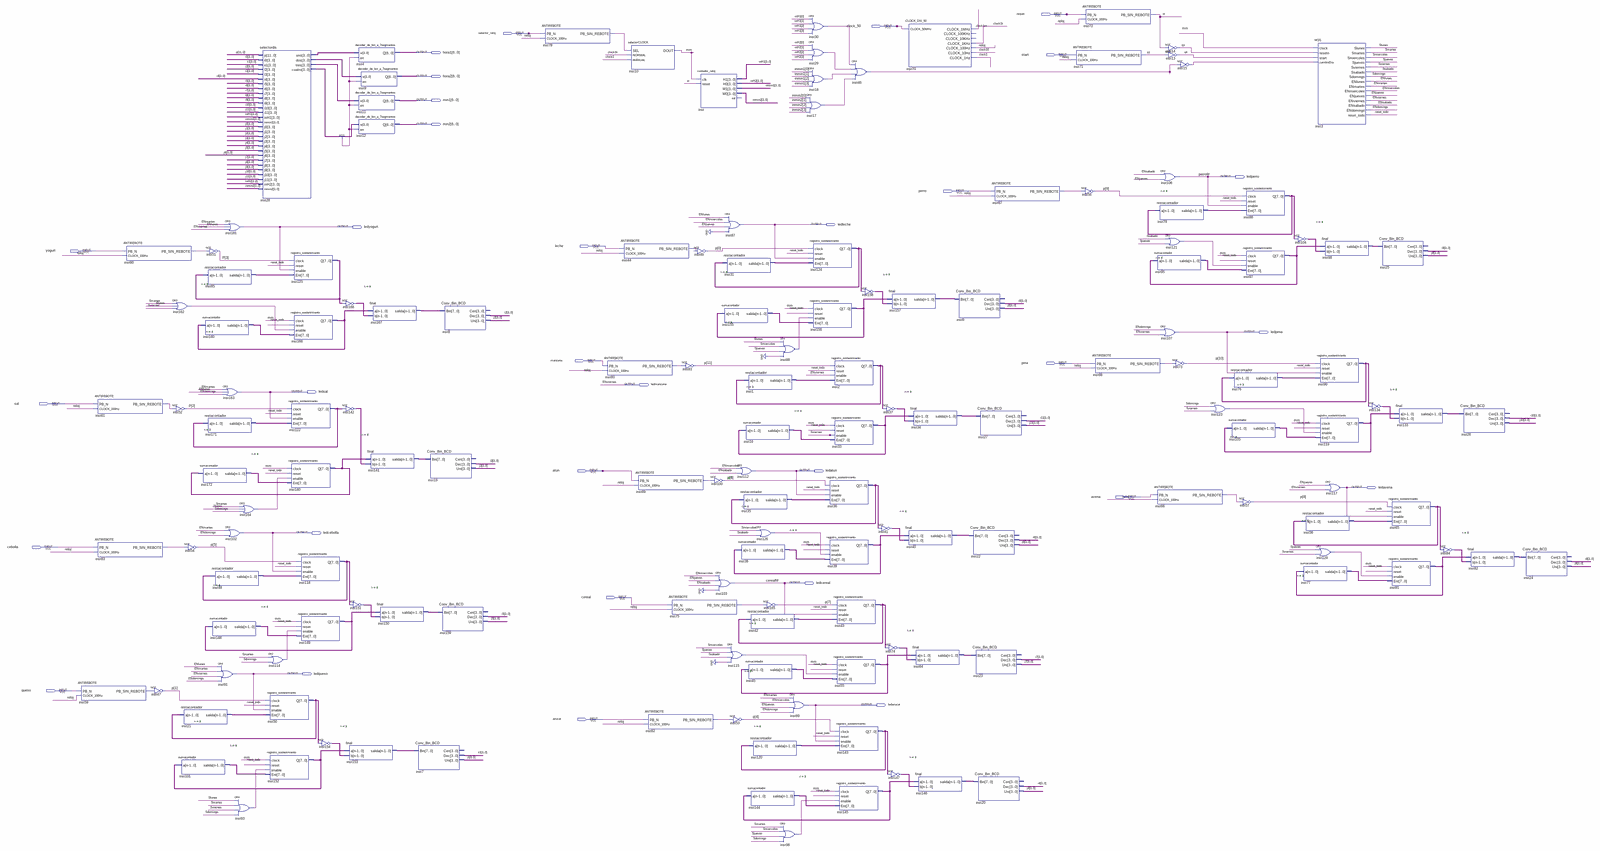
[diagram p0: schematic sheet, whole]
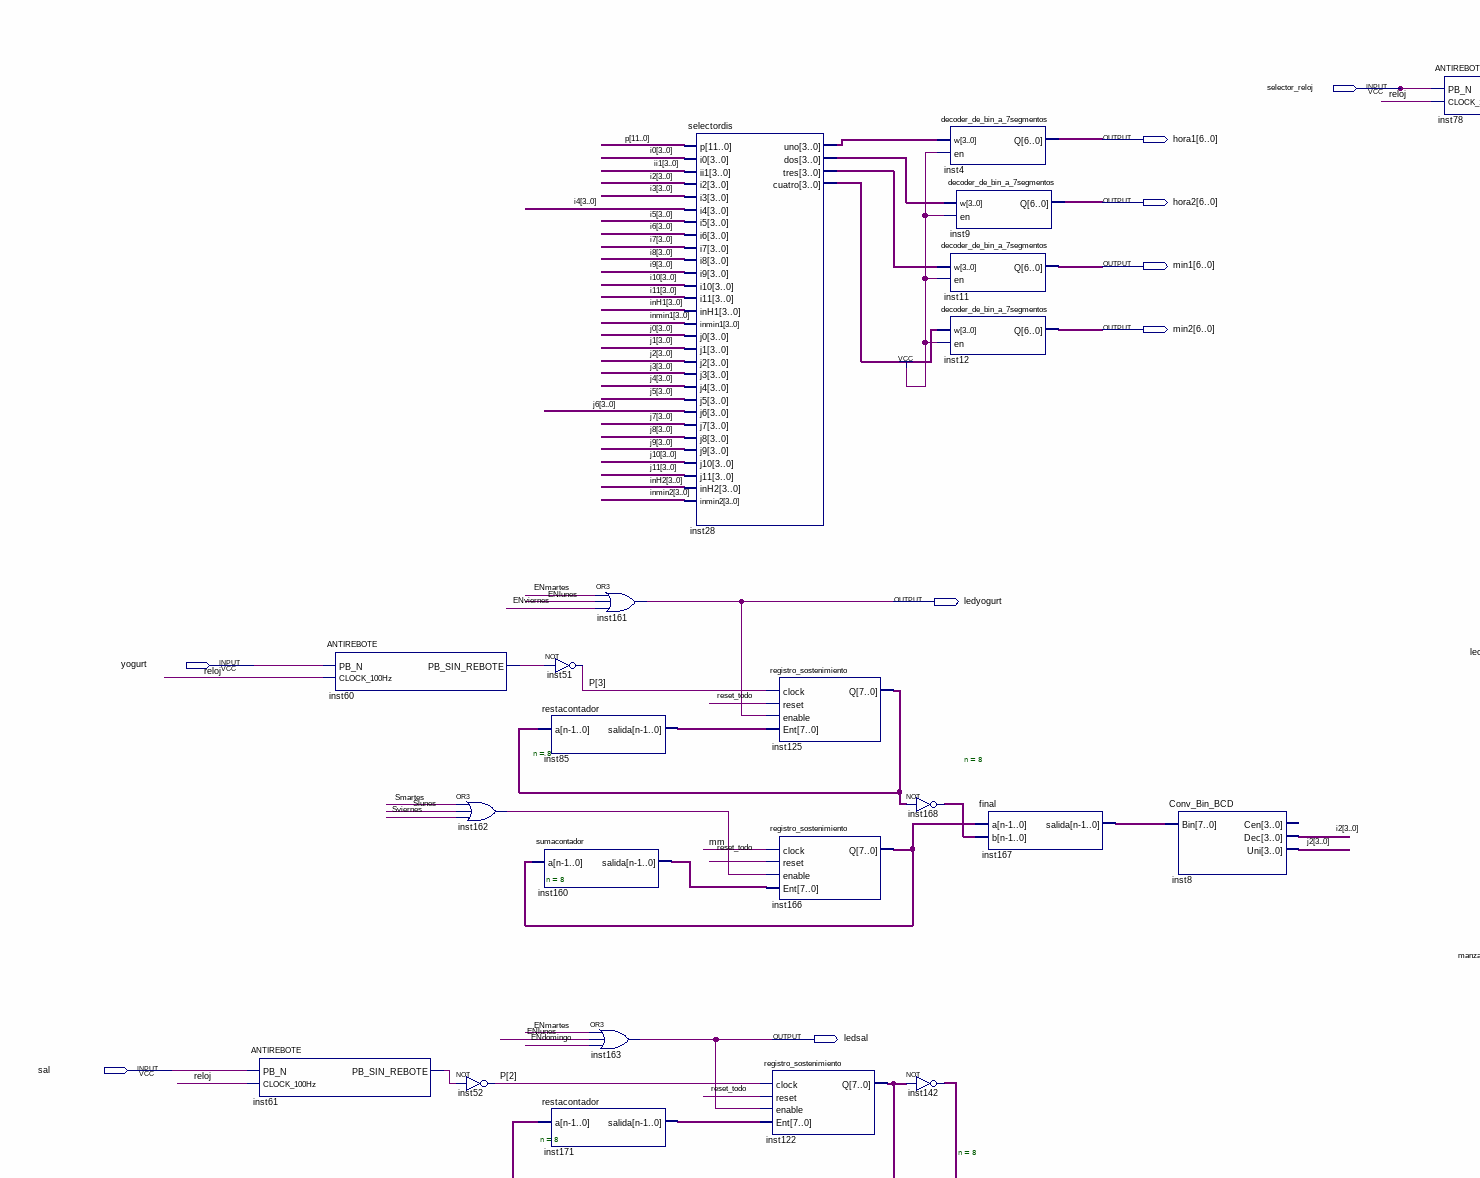
[diagram p1: schematic sheet, upper left part]
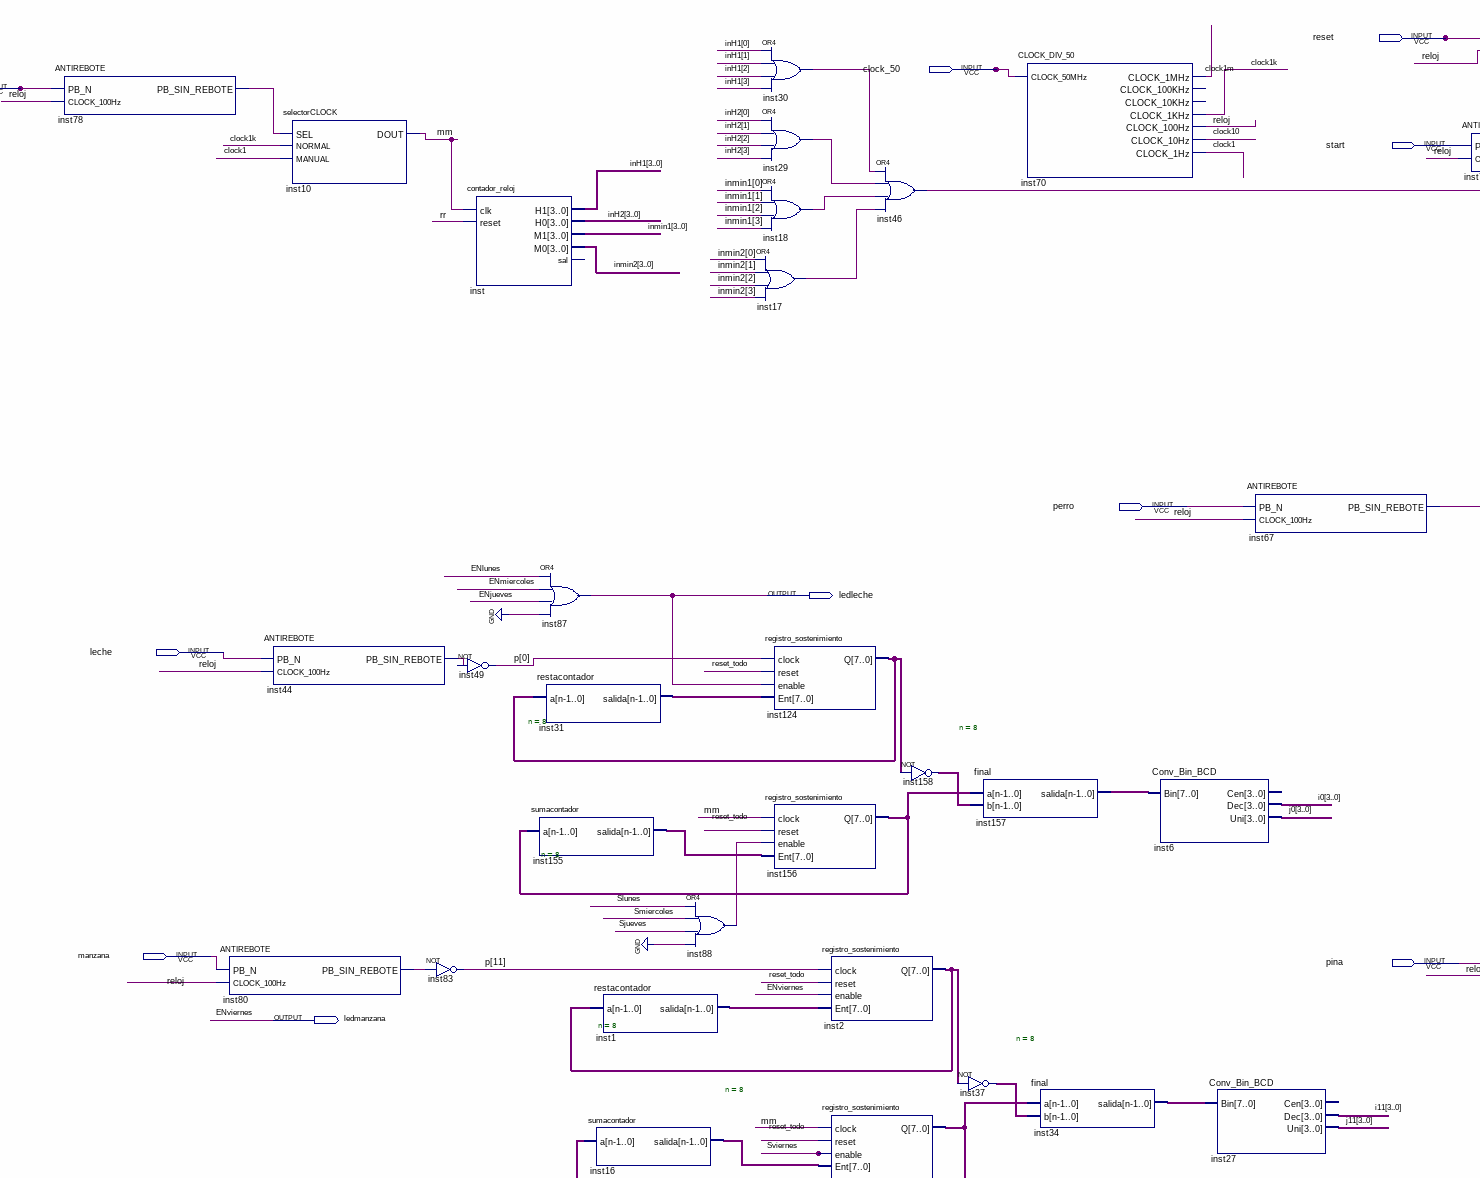
[diagram p2: schematic sheet, upper centre part]
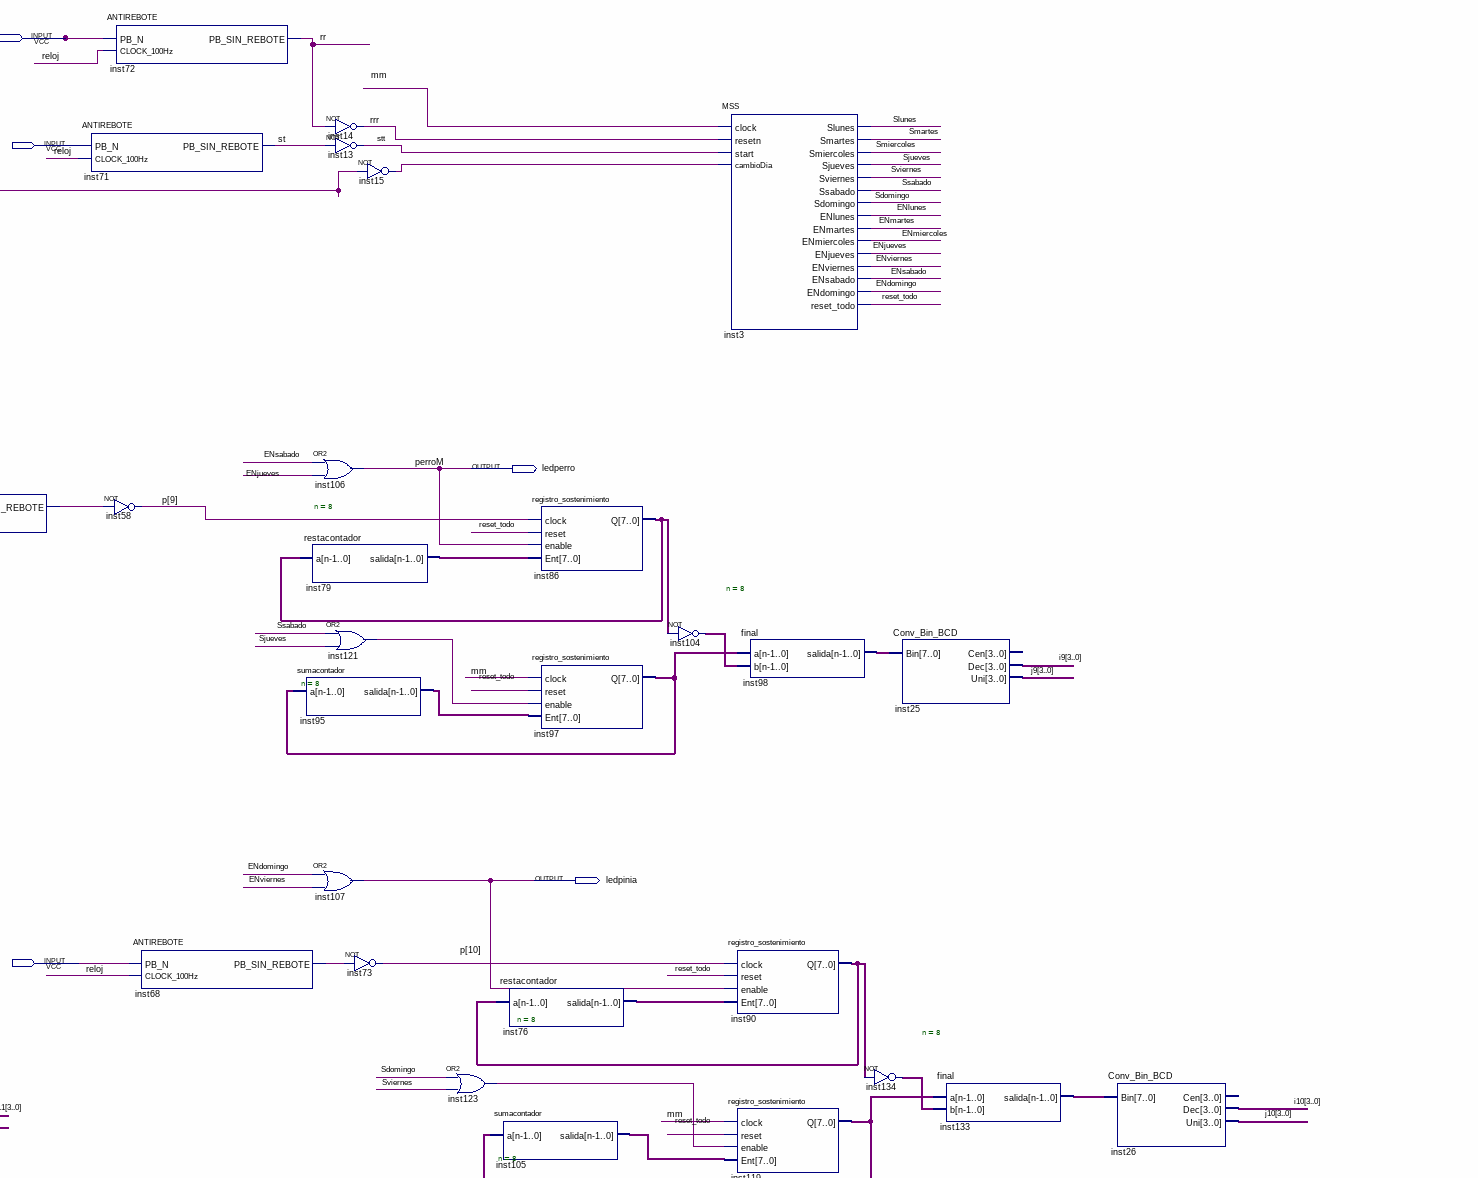
[diagram p3: schematic sheet, upper right part]
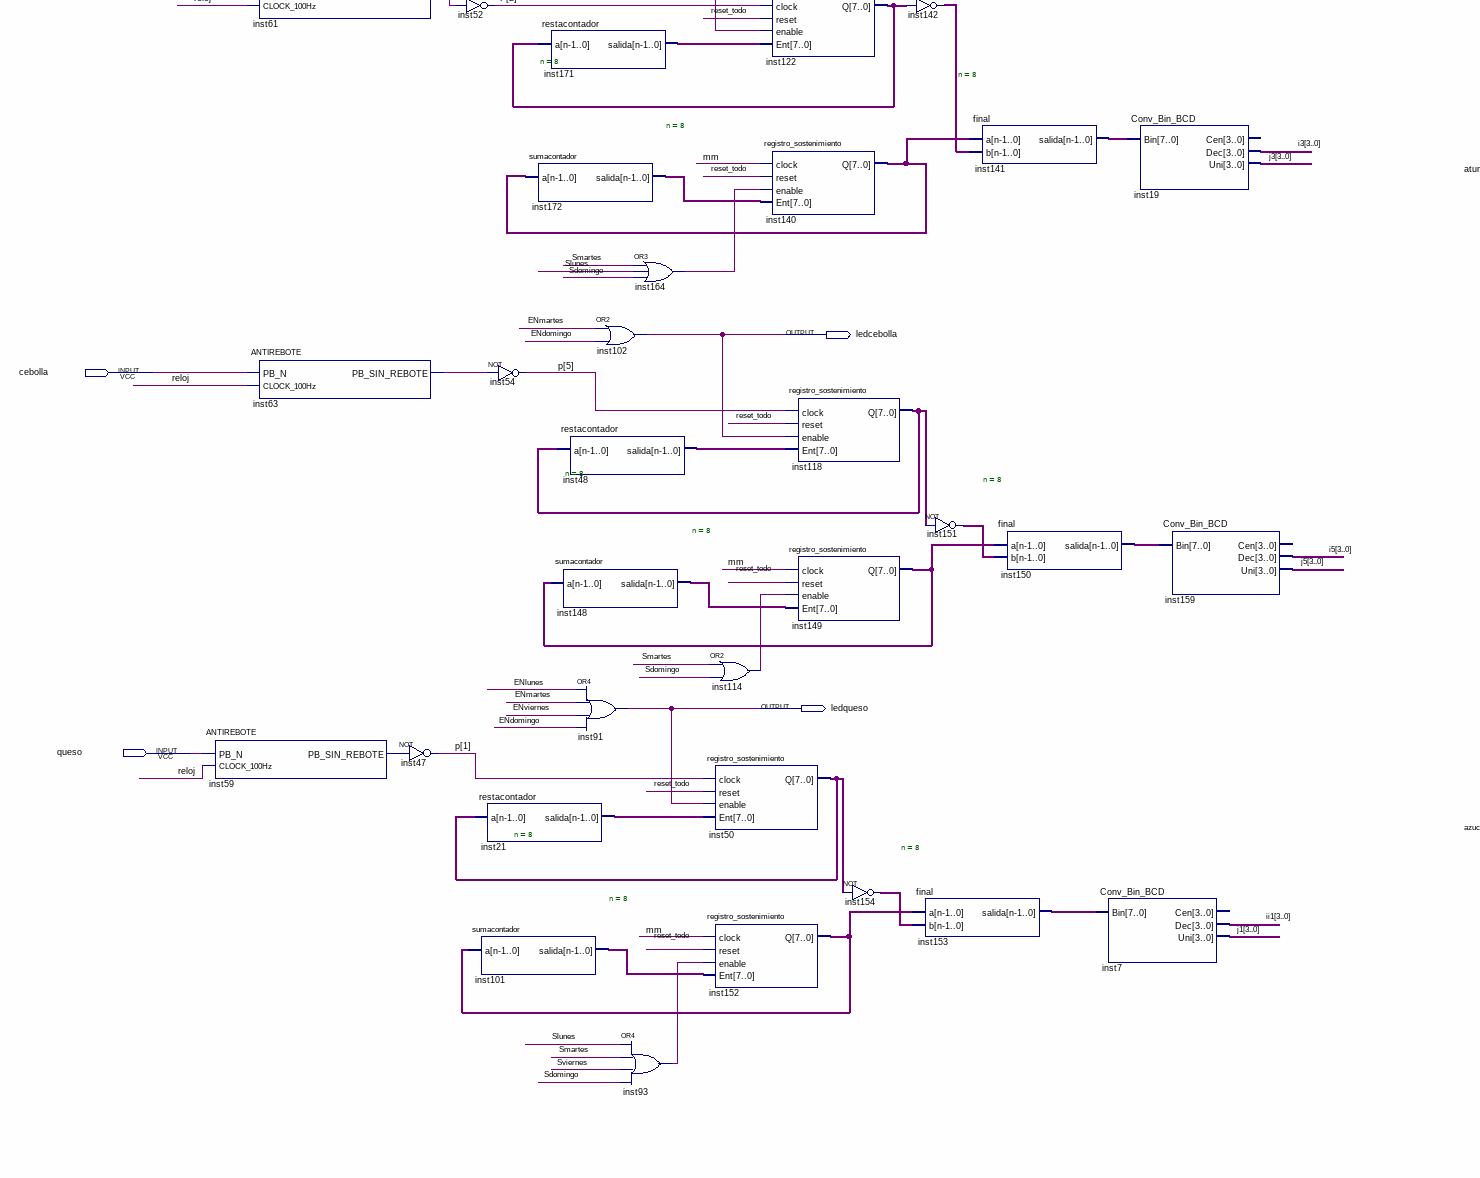
[diagram p4: schematic sheet, lower left part]
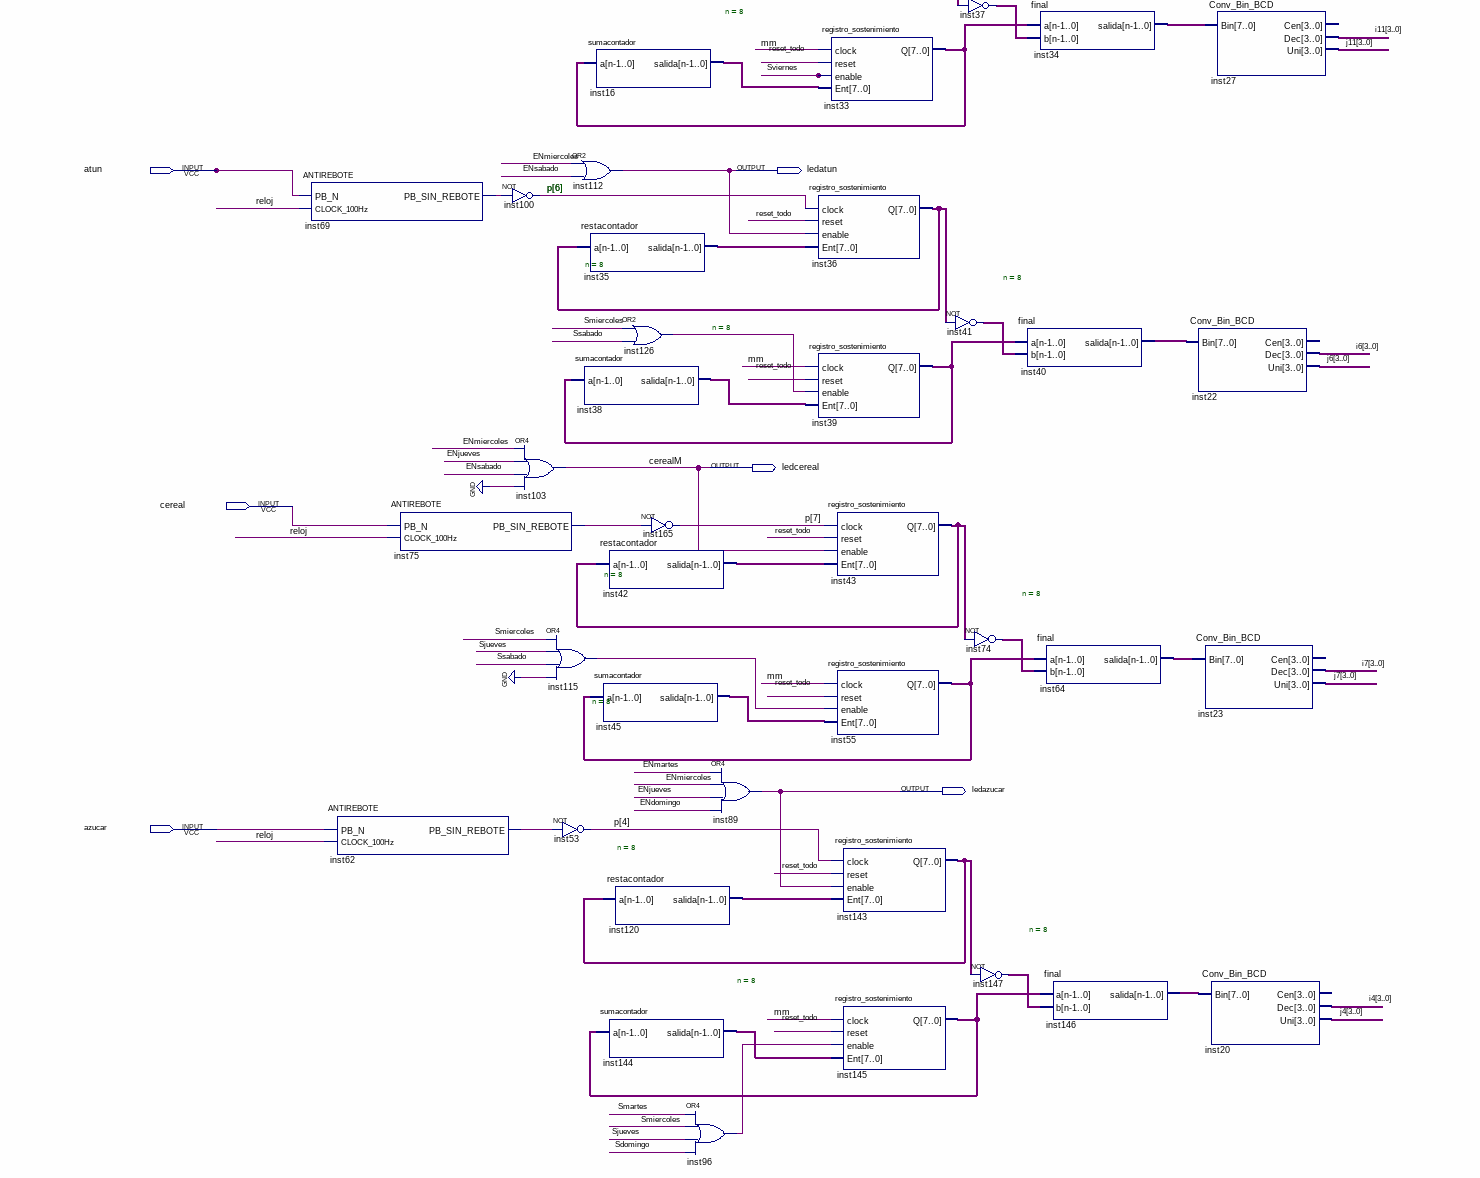
[diagram p5: schematic sheet, lower centre part]
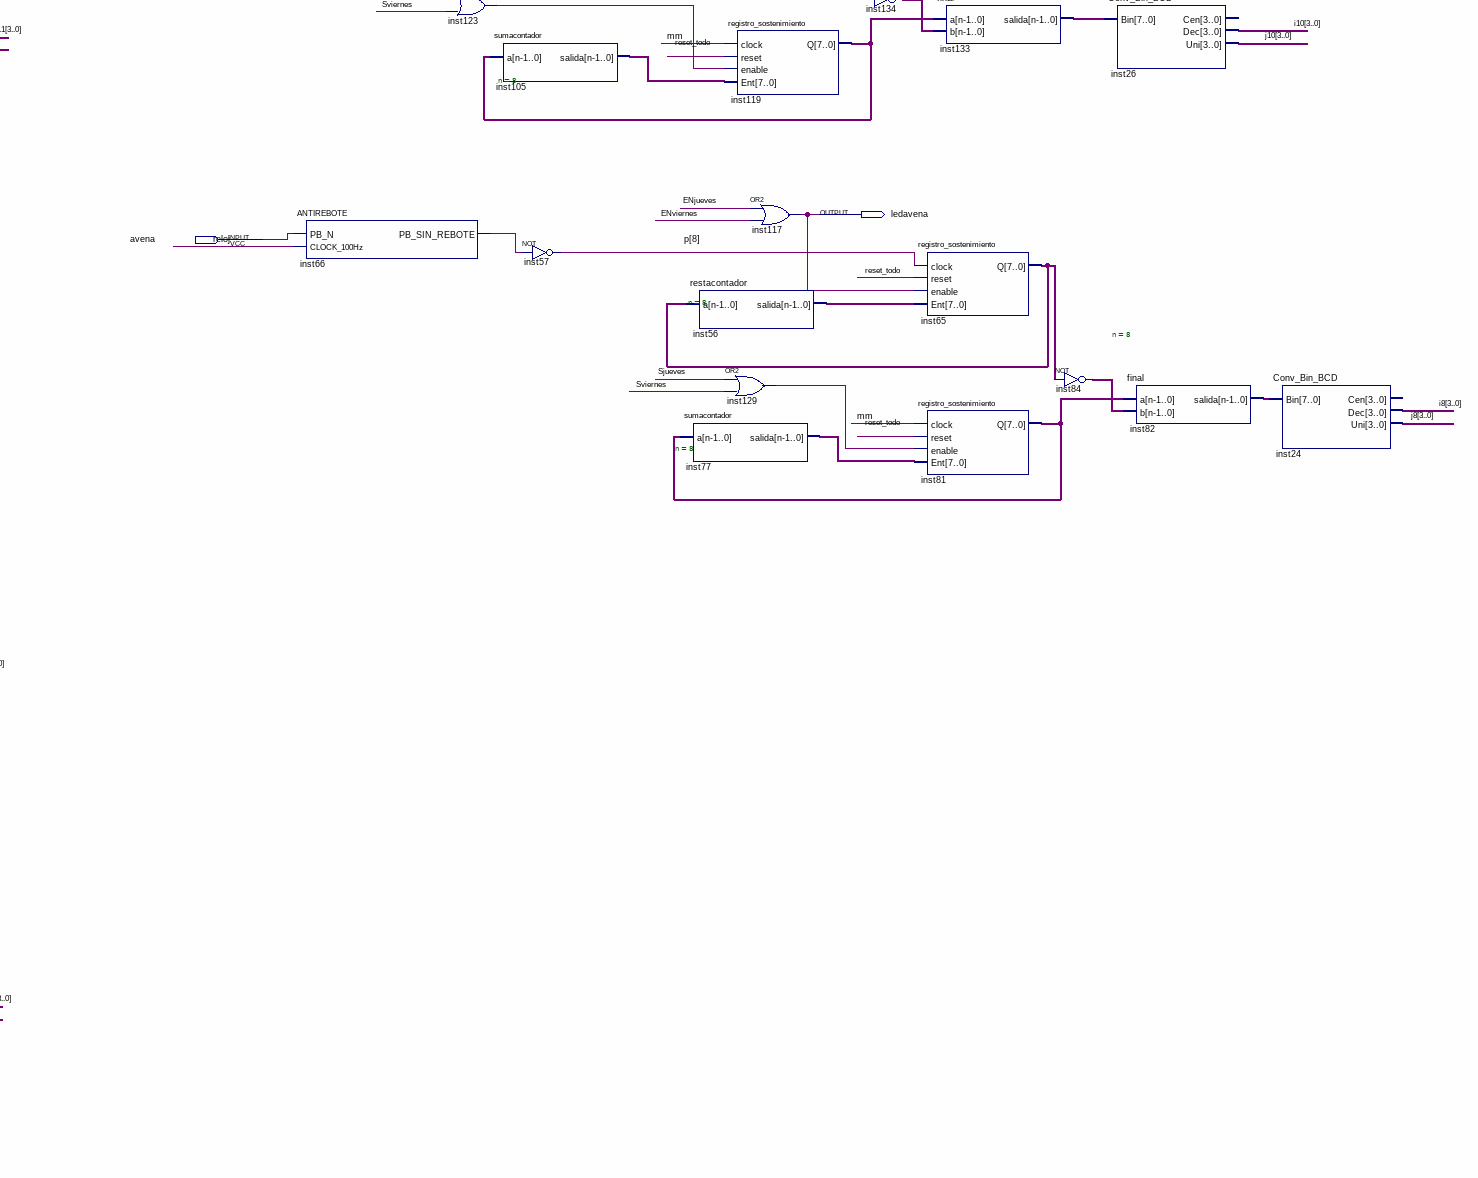
[diagram p6: schematic sheet, lower right part]
// Quartus schematic circuitoRR.bdf as structural Verilog: 150 symbols, 32 pins
module circuitoRR (
  input  reset,
  input  clock_50,
  input  selector_reloj,
  input  start,
  input  perro,
  input  leche,
  input  yogurt,
  input  manzana,
  input  pina,
  input  sal,
  input  atun,
  input  avena,
  input  cebolla,
  input  cereal,
  input  queso,
  input  azucar,
  output [6:0] hora1,
  output [6:0] hora2,
  output [6:0] min1,
  output [6:0] min2,
  output ledperro,
  output ledleche,
  output ledyogurt,
  output ledpinia,
  output ledmanzana,
  output ledsal,
  output ledatun,
  output ledavena,
  output ledcebolla,
  output ledcereal,
  output ledqueso,
  output ledazucar
);

  wire clock1, clock1k, clock1m, clock10, ENdomingo, ENjueves, ENlunes, ENmartes, ENmiercoles, ENsabado,
       inst15_out, inst17_out, inst18_out, inst29_out, inst30_out, inst44_pb_sin_rebote, inst46_out,
       inst59_pb_sin_rebote, inst60_pb_sin_rebote, inst61_pb_sin_rebote, inst62_pb_sin_rebote,
       inst63_pb_sin_rebote, inst66_pb_sin_rebote, inst67_pb_sin_rebote, inst68_pb_sin_rebote,
       inst69_pb_sin_rebote, inst75_pb_sin_rebote, inst78_pb_sin_rebote, inst80_pb_sin_rebote, inst88_out,
       inst93_out, inst96_out, inst114_out, inst115_out, inst121_out, inst123_out, inst126_out, inst129_out,
       inst162_out, inst164_out, mm, reloj, reset_todo, rr, rrr, Sdomingo, Sjueves, Slunes, Smartes,
       Smiercoles, Ssabado, st, stt, Sviernes;
  wire [3:0] i0, i2, i3, i4, i5, i6, i7, i8, i9, i10, i11, ii1, inH1, inH2, inmin1, inmin2, inst28_cuatro,
       inst28_dos, inst28_tres, inst28_uno, j0, j1, j2, j3, j4, j5, j6, j7, j8, j9, j10, j11;
  wire [7:0] inst1_salida, inst2_q, inst16_salida, inst21_salida, inst31_salida, inst33_q, inst34_salida,
       inst35_salida, inst36_q, inst37_out, inst38_salida, inst39_q, inst40_salida, inst41_out,
       inst42_salida, inst43_q, inst45_salida, inst48_salida, inst50_q, inst55_q, inst56_salida,
       inst64_salida, inst65_q, inst74_out, inst76_salida, inst77_salida, inst79_salida, inst81_q,
       inst82_salida, inst84_out, inst85_salida, inst86_q, inst90_q, inst95_salida, inst97_q, inst98_salida,
       inst101_salida, inst104_out, inst105_salida, inst118_q, inst119_q, inst120_salida, inst122_q,
       inst124_q, inst125_q, inst133_salida, inst134_out, inst140_q, inst141_salida, inst142_out, inst143_q,
       inst144_salida, inst145_q, inst146_salida, inst147_out, inst148_salida, inst149_q, inst150_salida,
       inst151_out, inst152_q, inst153_salida, inst154_out, inst155_salida, inst156_q, inst157_salida,
       inst158_out, inst160_salida, inst166_q, inst167_salida, inst168_out, inst171_salida, inst172_salida;
  wire [11:0] p;

  ANTIREBOTE inst59 (.PB_N(queso), .CLOCK_100Hz(reloj), .PB_SIN_REBOTE(inst59_pb_sin_rebote));
  ANTIREBOTE inst61 (.PB_N(sal), .CLOCK_100Hz(reloj), .PB_SIN_REBOTE(inst61_pb_sin_rebote));
  ANTIREBOTE inst63 (.PB_N(cebolla), .CLOCK_100Hz(reloj), .PB_SIN_REBOTE(inst63_pb_sin_rebote));
  ANTIREBOTE inst60 (.PB_N(yogurt), .CLOCK_100Hz(reloj), .PB_SIN_REBOTE(inst60_pb_sin_rebote));
  not inst47 (p[1], inst59_pb_sin_rebote);
  or inst162 (inst162_out, Smartes, Slunes, Sviernes);
  not inst52 (p[2], inst61_pb_sin_rebote);
  sumacontador #(.n(8)) inst101 (.a(inst152_q), .salida(inst101_salida));
  not inst54 (p[5], inst63_pb_sin_rebote);
  restacontador #(.n(8)) inst21 (.a(inst50_q), .salida(inst21_salida));
  not inst51 (p[3], inst60_pb_sin_rebote);
  restacontador #(.n(8)) inst85 (.a(inst125_q), .salida(inst85_salida));
  sumacontador #(.n(8)) inst160 (.a(inst166_q), .salida(inst160_salida));
  restacontador #(.n(8)) inst171 (.a(inst122_q), .salida(inst171_salida));
  sumacontador #(.n(8)) inst172 (.a(inst140_q), .salida(inst172_salida));
  restacontador #(.n(8)) inst48 (.a(inst118_q), .salida(inst48_salida));
  sumacontador #(.n(8)) inst148 (.a(inst149_q), .salida(inst148_salida));
  or inst161 (ledyogurt, ENmartes, ENlunes, ledmanzana);
  or inst163 (ledsal, ENmartes, ENlunes, ENdomingo);
  or inst102 (ledcebolla, ENmartes, ENdomingo);
  or inst91 (ledqueso, ENlunes, ENmartes, ledmanzana, ENdomingo);
  or inst93 (inst93_out, Slunes, Smartes, Sviernes, Sdomingo);
  or inst164 (inst164_out, Smartes, Slunes, Sdomingo);
  selectordis inst28 (
    .p(p), .i0(i0), .ii1(ii1), .i2(i2), .i3(i3), .i4(i4), .i5(i5), .i6(i6), .i7(i7), .i8(i8), .i9(i9),
    .i10(i10), .i11(i11), .inH1(inH1), .inmin1(inmin1), .j0(j0), .j1(j1), .j2(j2), .j3(j3), .j4(j4), .j5(j5),
    .j6(j6), .j7(j7), .j8(j8), .j9(j9), .j10(j10), .j11(j11), .inH2(inH2), .inmin2(inmin2), .uno(inst28_uno),
    .dos(inst28_dos), .tres(inst28_tres), .cuatro(inst28_cuatro));
  or inst114 (inst114_out, Smartes, Sdomingo);
  registro_sostenimiento inst50 (
    .clock(p[1]), .reset(reset_todo), .enable(ledqueso), .Ent(inst21_salida), .Q(inst50_q));
  registro_sostenimiento inst152 (
    .clock(mm), .reset(reset_todo), .enable(inst93_out), .Ent(inst101_salida), .Q(inst152_q));
  registro_sostenimiento inst125 (
    .clock(p[3]), .reset(reset_todo), .enable(ledyogurt), .Ent(inst85_salida), .Q(inst125_q));
  registro_sostenimiento inst166 (
    .clock(mm), .reset(reset_todo), .enable(inst162_out), .Ent(inst160_salida), .Q(inst166_q));
  registro_sostenimiento inst122 (
    .clock(p[2]), .reset(reset_todo), .enable(ledsal), .Ent(inst171_salida), .Q(inst122_q));
  registro_sostenimiento inst140 (
    .clock(mm), .reset(reset_todo), .enable(inst164_out), .Ent(inst172_salida), .Q(inst140_q));
  registro_sostenimiento inst118 (
    .clock(p[5]), .reset(reset_todo), .enable(ledcebolla), .Ent(inst48_salida), .Q(inst118_q));
  registro_sostenimiento inst149 (
    .clock(mm), .reset(reset_todo), .enable(inst114_out), .Ent(inst148_salida), .Q(inst149_q));
  assign inst154_out = ~inst50_q;  // NOT inst154, 8 bits wide
  assign inst168_out = ~inst125_q;  // NOT inst168, 8 bits wide
  assign inst142_out = ~inst122_q;  // NOT inst142, 8 bits wide
  assign inst151_out = ~inst118_q;  // NOT inst151, 8 bits wide
  \final  #(.n(8)) inst153 (.a(inst152_q), .b(inst154_out), .salida(inst153_salida));
  decoder_de_bin_a_7segmentos inst4 (.w(inst28_uno), .en(1'b1), .Q(hora1));
  decoder_de_bin_a_7segmentos inst9 (.w(inst28_dos), .en(1'b1), .Q(hora2));
  decoder_de_bin_a_7segmentos inst11 (.w(inst28_tres), .en(1'b1), .Q(min1));
  decoder_de_bin_a_7segmentos inst12 (.w(inst28_cuatro), .en(1'b1), .Q(min2));
  \final  #(.n(8)) inst167 (.a(inst166_q), .b(inst168_out), .salida(inst167_salida));
  \final  #(.n(8)) inst141 (.a(inst140_q), .b(inst142_out), .salida(inst141_salida));
  \final  #(.n(8)) inst150 (.a(inst149_q), .b(inst151_out), .salida(inst150_salida));
  Conv_Bin_BCD inst19 (.Bin(inst141_salida), .Dec(i3), .Uni(j3));  // open: Cen
  Conv_Bin_BCD inst7 (.Bin(inst153_salida), .Dec(ii1), .Uni(j1));  // open: Cen
  Conv_Bin_BCD inst8 (.Bin(inst167_salida), .Dec(i2), .Uni(j2));  // open: Cen
  Conv_Bin_BCD inst159 (.Bin(inst150_salida), .Dec(i5), .Uni(j5));  // open: Cen
  ANTIREBOTE inst78 (.PB_N(selector_reloj), .CLOCK_100Hz(reloj), .PB_SIN_REBOTE(inst78_pb_sin_rebote));
  ANTIREBOTE inst80 (.PB_N(manzana), .CLOCK_100Hz(reloj), .PB_SIN_REBOTE(inst80_pb_sin_rebote));
  selectorCLOCK inst10 (.SEL(inst78_pb_sin_rebote), .NORMAL(clock1k), .MANUAL(clock1), .DOUT(mm));
  ANTIREBOTE inst44 (.PB_N(leche), .CLOCK_100Hz(reloj), .PB_SIN_REBOTE(inst44_pb_sin_rebote));
  ANTIREBOTE inst69 (.PB_N(atun), .CLOCK_100Hz(reloj), .PB_SIN_REBOTE(inst69_pb_sin_rebote));
  ANTIREBOTE inst62 (.PB_N(azucar), .CLOCK_100Hz(reloj), .PB_SIN_REBOTE(inst62_pb_sin_rebote));
  ANTIREBOTE inst75 (.PB_N(cereal), .CLOCK_100Hz(reloj), .PB_SIN_REBOTE(inst75_pb_sin_rebote));
  not inst49 (p[0], inst44_pb_sin_rebote);
  not inst83 (p[11], inst80_pb_sin_rebote);
  contador_reloj inst (.clk(mm), .reset(rr), .H1(inH1), .H0(inH2), .M1(inmin1), .M0(inmin2));  // open: sal
  not inst100 (p[6], inst69_pb_sin_rebote);
  or inst87 (ledleche, ENlunes, ENmiercoles, ENjueves, 1'b0);
  restacontador #(.n(8)) inst31 (.a(inst124_q), .salida(inst31_salida));
  sumacontador #(.n(8)) inst155 (.a(inst156_q), .salida(inst155_salida));
  or inst103 (ledcereal, ENmiercoles, ENjueves, ENsabado, 1'b0);
  or inst115 (inst115_out, Smiercoles, Sjueves, Ssabado, 1'b0);
  not inst53 (p[4], inst62_pb_sin_rebote);
  restacontador #(.n(8)) inst1 (.a(inst2_q), .salida(inst1_salida));
  sumacontador #(.n(8)) inst16 (.a(inst33_q), .salida(inst16_salida));
  or inst112 (ledatun, ENmiercoles, ENsabado);
  restacontador #(.n(8)) inst35 (.a(inst36_q), .salida(inst35_salida));
  sumacontador #(.n(8)) inst38 (.a(inst39_q), .salida(inst38_salida));
  restacontador #(.n(8)) inst42 (.a(inst43_q), .salida(inst42_salida));
  sumacontador #(.n(8)) inst45 (.a(inst55_q), .salida(inst45_salida));
  restacontador #(.n(8)) inst120 (.a(inst143_q), .salida(inst120_salida));
  sumacontador #(.n(8)) inst144 (.a(inst145_q), .salida(inst144_salida));
  or inst126 (inst126_out, Smiercoles, Ssabado);
  not inst165 (p[7], inst75_pb_sin_rebote);
  or inst88 (inst88_out, Slunes, Smiercoles, Sjueves, 1'b0);
  or inst89 (ledazucar, ENmartes, ENmiercoles, ENjueves, ENdomingo);
  or inst96 (inst96_out, Smartes, Smiercoles, Sjueves, Sdomingo);
  or inst30 (inst30_out, inH1[0], inH1[1], inH1[2], inH1[3]);
  or inst29 (inst29_out, inH2[0], inH2[1], inH2[2], inH2[3]);
  or inst18 (inst18_out, inmin1[0], inmin1[1], inmin1[2], inmin1[3]);
  or inst17 (inst17_out, inmin2[0], inmin2[1], inmin2[2], inmin2[3]);
  registro_sostenimiento inst124 (
    .clock(p[0]), .reset(reset_todo), .enable(ledleche), .Ent(inst31_salida), .Q(inst124_q));
  registro_sostenimiento inst156 (
    .clock(mm), .reset(reset_todo), .enable(inst88_out), .Ent(inst155_salida), .Q(inst156_q));
  registro_sostenimiento inst36 (.clock(p[6]), .reset(reset_todo), .enable(ledatun), .Ent(inst35_salida), .Q(inst36_q));
  registro_sostenimiento inst39 (
    .clock(mm), .reset(reset_todo), .enable(inst126_out), .Ent(inst38_salida), .Q(inst39_q));
  registro_sostenimiento inst2 (
    .clock(p[11]), .reset(reset_todo), .enable(ledmanzana), .Ent(inst1_salida), .Q(inst2_q));
  registro_sostenimiento inst33 (.clock(mm), .reset(reset_todo), .enable(Sviernes), .Ent(inst16_salida), .Q(inst33_q));
  registro_sostenimiento inst43 (
    .clock(p[7]), .reset(reset_todo), .enable(ledcereal), .Ent(inst42_salida), .Q(inst43_q));
  registro_sostenimiento inst55 (
    .clock(mm), .reset(reset_todo), .enable(inst115_out), .Ent(inst45_salida), .Q(inst55_q));
  registro_sostenimiento inst143 (
    .clock(p[4]), .reset(reset_todo), .enable(ledazucar), .Ent(inst120_salida), .Q(inst143_q));
  registro_sostenimiento inst145 (
    .clock(mm), .reset(reset_todo), .enable(inst96_out), .Ent(inst144_salida), .Q(inst145_q));
  or inst46 (inst46_out, inst30_out, inst29_out, inst18_out, inst17_out);
  assign inst158_out = ~inst124_q;  // NOT inst158, 8 bits wide
  assign inst37_out = ~inst2_q;  // NOT inst37, 8 bits wide
  assign inst41_out = ~inst36_q;  // NOT inst41, 8 bits wide
  assign inst74_out = ~inst43_q;  // NOT inst74, 8 bits wide
  CLOCK_DIV_50 inst70 (
    .CLOCK_50MHz(clock_50), .CLOCK_1MHz(clock1m), .CLOCK_1KHz(clock1k), .CLOCK_100Hz(reloj),
    .CLOCK_10Hz(clock10), .CLOCK_1Hz(clock1));  // open: CLOCK_100KHz, CLOCK_10KHz
  \final  #(.n(8)) inst157 (.a(inst156_q), .b(inst158_out), .salida(inst157_salida));
  \final  #(.n(8)) inst40 (.a(inst39_q), .b(inst41_out), .salida(inst40_salida));
  assign inst147_out = ~inst143_q;  // NOT inst147, 8 bits wide
  \final  #(.n(8)) inst34 (.a(inst33_q), .b(inst37_out), .salida(inst34_salida));
  \final  #(.n(8)) inst64 (.a(inst55_q), .b(inst74_out), .salida(inst64_salida));
  \final  #(.n(8)) inst146 (.a(inst145_q), .b(inst147_out), .salida(inst146_salida));
  Conv_Bin_BCD inst6 (.Bin(inst157_salida), .Dec(i0), .Uni(j0));  // open: Cen
  Conv_Bin_BCD inst27 (.Bin(inst34_salida), .Dec(i11), .Uni(j11));  // open: Cen
  Conv_Bin_BCD inst22 (.Bin(inst40_salida), .Dec(i6), .Uni(j6));  // open: Cen
  Conv_Bin_BCD inst23 (.Bin(inst64_salida), .Dec(i7), .Uni(j7));  // open: Cen
  Conv_Bin_BCD inst20 (.Bin(inst146_salida), .Dec(i4), .Uni(j4));  // open: Cen
  ANTIREBOTE inst67 (.PB_N(perro), .CLOCK_100Hz(reloj), .PB_SIN_REBOTE(inst67_pb_sin_rebote));
  ANTIREBOTE inst71 (.PB_N(start), .CLOCK_100Hz(reloj), .PB_SIN_REBOTE(st));
  ANTIREBOTE inst72 (.PB_N(reset), .CLOCK_100Hz(reloj), .PB_SIN_REBOTE(rr));
  not inst58 (p[9], inst67_pb_sin_rebote);
  ANTIREBOTE inst68 (.PB_N(pina), .CLOCK_100Hz(reloj), .PB_SIN_REBOTE(inst68_pb_sin_rebote));
  sumacontador #(.n(8)) inst95 (.a(inst97_q), .salida(inst95_salida));
  ANTIREBOTE inst66 (.PB_N(avena), .CLOCK_100Hz(reloj), .PB_SIN_REBOTE(inst66_pb_sin_rebote));
  not inst14 (rrr, rr);
  not inst13 (stt, st);
  or inst106 (ledperro, ENsabado, ENjueves);
  restacontador #(.n(8)) inst79 (.a(inst86_q), .salida(inst79_salida));
  or inst121 (inst121_out, Ssabado, Sjueves);
  or inst107 (ledpinia, ENdomingo, ledmanzana);
  not inst73 (p[10], inst68_pb_sin_rebote);
  not inst15 (inst15_out, inst46_out);
  or inst123 (inst123_out, Sdomingo, Sviernes);
  restacontador #(.n(8)) inst76 (.a(inst90_q), .salida(inst76_salida));
  sumacontador #(.n(8)) inst105 (.a(inst119_q), .salida(inst105_salida));
  registro_sostenimiento inst86 (
    .clock(p[9]), .reset(reset_todo), .enable(ledperro), .Ent(inst79_salida), .Q(inst86_q));
  registro_sostenimiento inst97 (
    .clock(mm), .reset(reset_todo), .enable(inst121_out), .Ent(inst95_salida), .Q(inst97_q));
  not inst57 (p[8], inst66_pb_sin_rebote);
  assign inst104_out = ~inst86_q;  // NOT inst104, 8 bits wide
  restacontador #(.n(8)) inst56 (.a(inst65_q), .salida(inst56_salida));
  sumacontador #(.n(8)) inst77 (.a(inst81_q), .salida(inst77_salida));
  MSS inst3 (
    .clock(mm), .resetn(rrr), .start(stt), .cambioDia(inst15_out), .Slunes(Slunes), .Smartes(Smartes),
    .Smiercoles(Smiercoles), .Sjueves(Sjueves), .Sviernes(Sviernes), .Ssabado(Ssabado), .Sdomingo(Sdomingo),
    .ENlunes(ENlunes), .ENmartes(ENmartes), .ENmiercoles(ENmiercoles), .ENjueves(ENjueves),
    .ENviernes(ledmanzana), .ENsabado(ENsabado), .ENdomingo(ENdomingo), .reset_todo(reset_todo));
  \final  #(.n(8)) inst98 (.a(inst97_q), .b(inst104_out), .salida(inst98_salida));
  registro_sostenimiento inst90 (
    .clock(p[10]), .reset(reset_todo), .enable(ledpinia), .Ent(inst76_salida), .Q(inst90_q));
  registro_sostenimiento inst119 (
    .clock(mm), .reset(reset_todo), .enable(inst123_out), .Ent(inst105_salida), .Q(inst119_q));
  or inst117 (ledavena, ENjueves, ledmanzana);
  or inst129 (inst129_out, Sjueves, Sviernes);
  Conv_Bin_BCD inst25 (.Bin(inst98_salida), .Dec(i9), .Uni(j9));  // open: Cen
  assign inst134_out = ~inst90_q;  // NOT inst134, 8 bits wide
  \final  #(.n(8)) inst133 (.a(inst119_q), .b(inst134_out), .salida(inst133_salida));
  registro_sostenimiento inst65 (
    .clock(p[8]), .reset(reset_todo), .enable(ledavena), .Ent(inst56_salida), .Q(inst65_q));
  registro_sostenimiento inst81 (
    .clock(mm), .reset(reset_todo), .enable(inst129_out), .Ent(inst77_salida), .Q(inst81_q));
  assign inst84_out = ~inst65_q;  // NOT inst84, 8 bits wide
  Conv_Bin_BCD inst26 (.Bin(inst133_salida), .Dec(i10), .Uni(j10));  // open: Cen
  \final  #(.n(8)) inst82 (.a(inst81_q), .b(inst84_out), .salida(inst82_salida));
  Conv_Bin_BCD inst24 (.Bin(inst82_salida), .Dec(i8), .Uni(j8));  // open: Cen

  // Other names for the same wires on the sheet: cerealM = ledcereal; ENviernes = ledmanzana; perroM = ledperro

  // Notes on the sheet:
  //   p[6]
endmodule
